# Altium schematic sheet LTC7872.SchDoc
size 985 x 607 mm
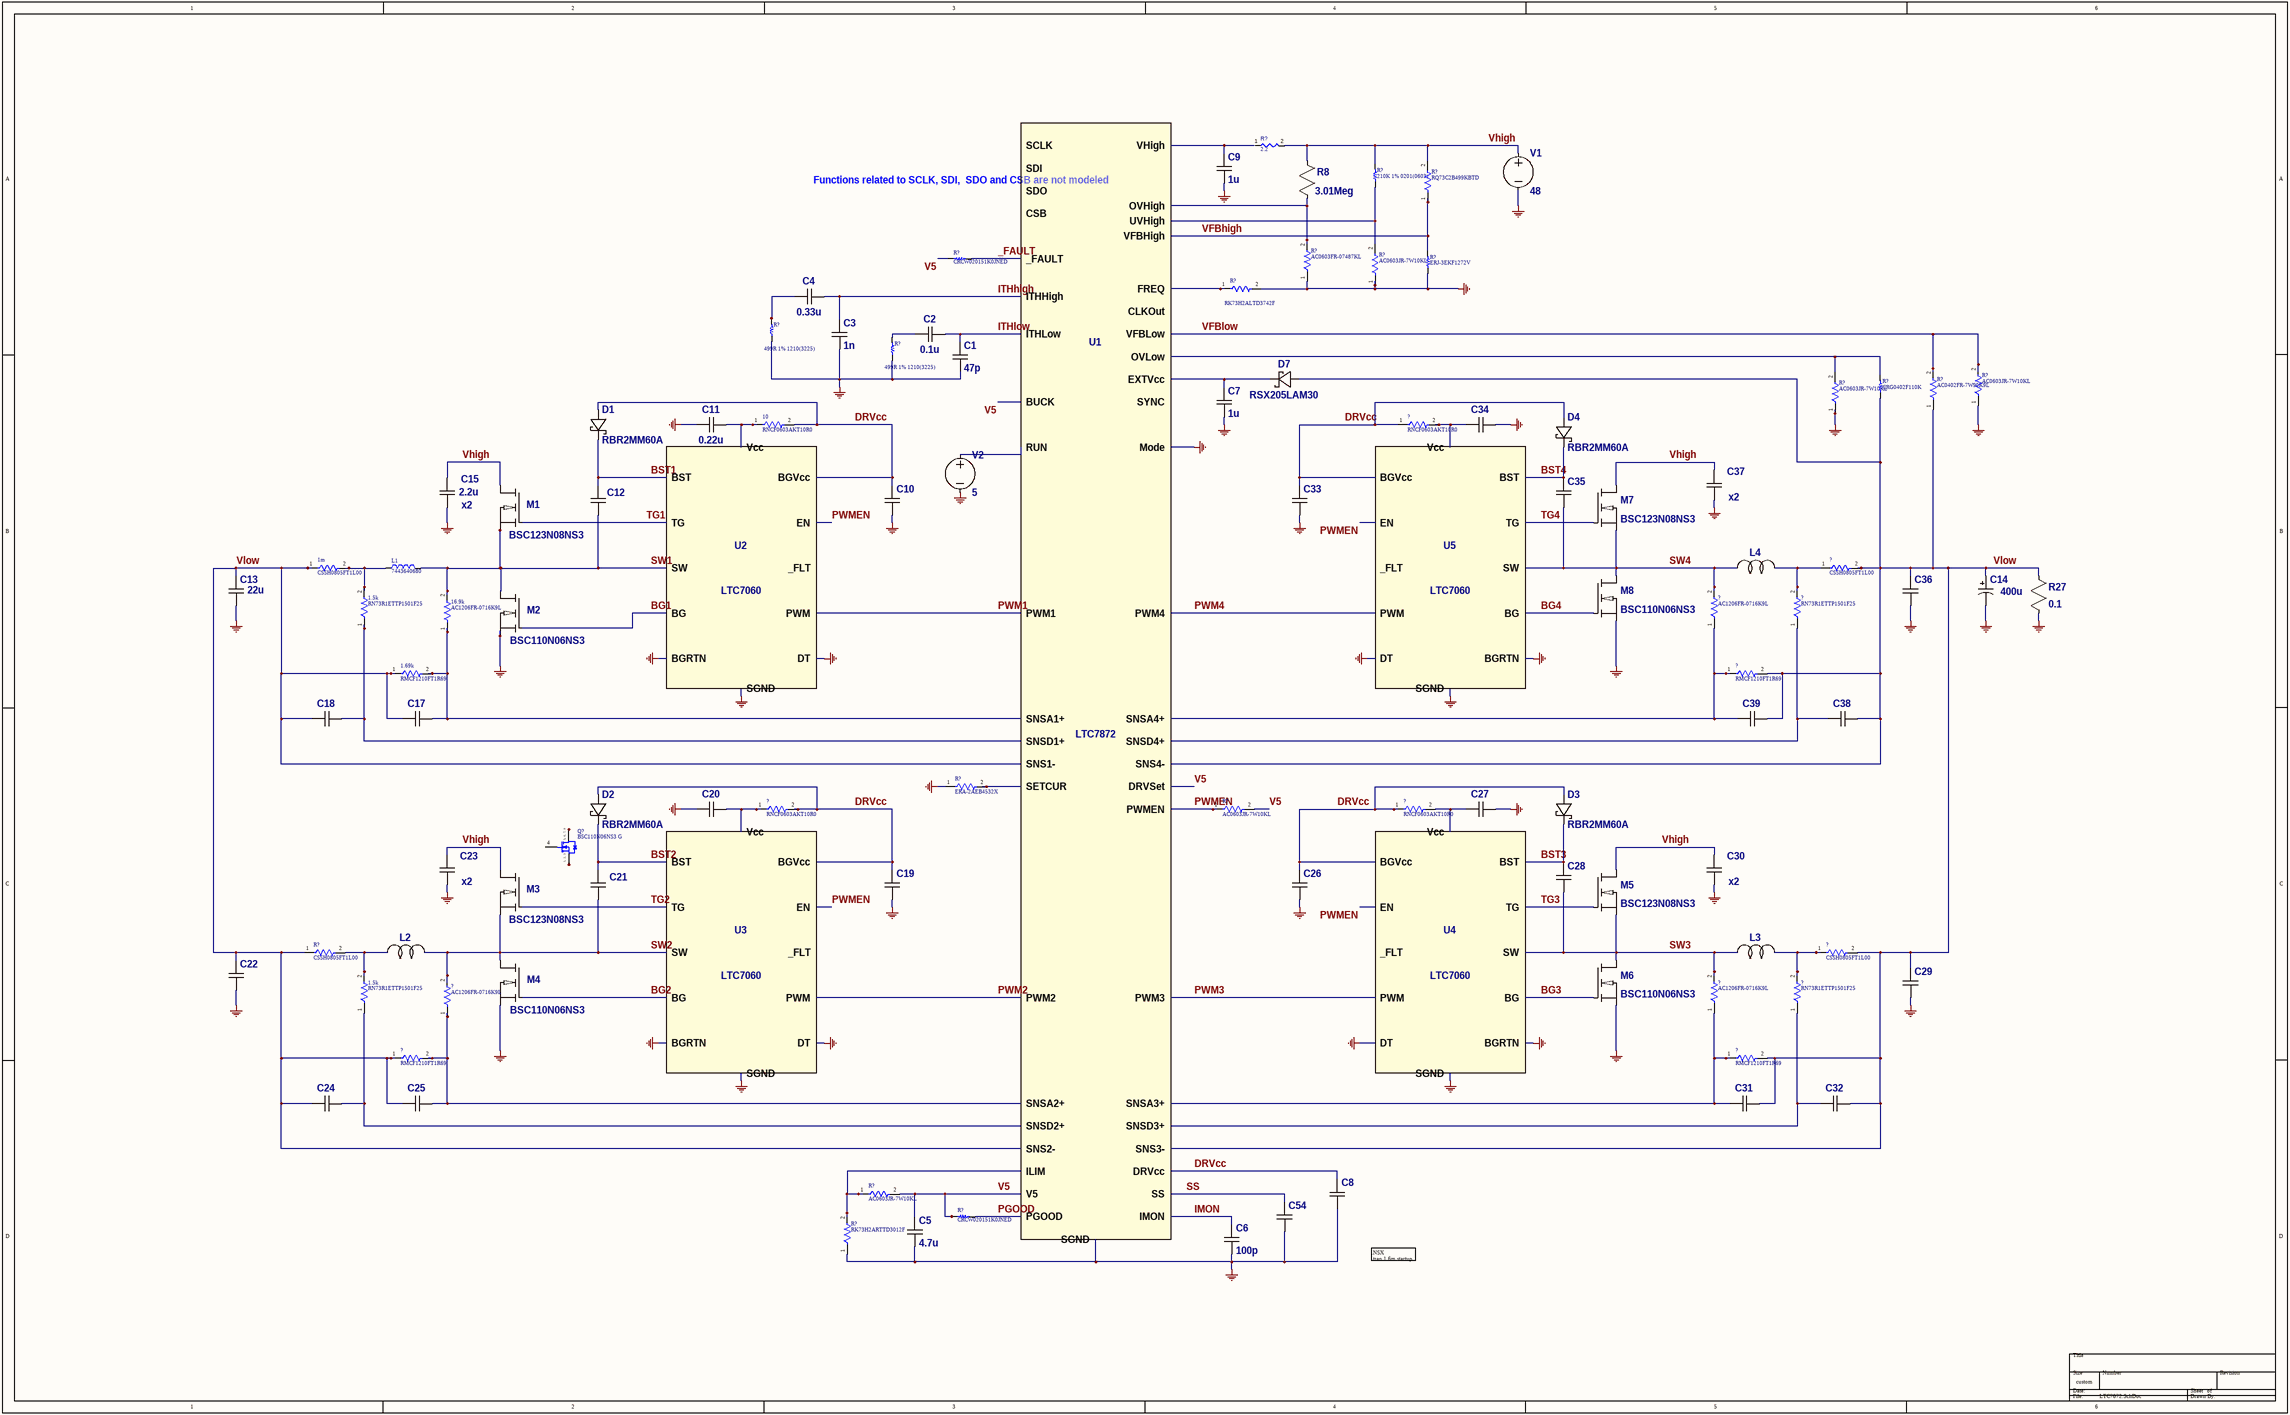
[diagram p0: LTC7872.SchDoc]

## Parts
(Parts that share a designator on the sheet are numbered #1, #2 ... from top to bottom, then left to right.)
1.5k#1  RN73R1ETTP1501F25  [FP-RN73R1E-MFG]
1.5k#2  RN73R1ETTP1501F25  [FP-RN73R1E-MFG]
1.69k  RMCF1210FT1R69  [FP-RMCF1210-IPC_C]
1m  CSSH0805FT1L00  [FP-CSSH0805FT1L00-MFG]
10  RNCF0603AKT10R0  [FP-RNCF0603-MFG]
16.9k  AC1206FR-0716K9L  [FP-AC1206-MFG]
?#1  RNCF0603AKT10R0  [FP-RNCF0603-MFG]
?#2  CSSH0805FT1L00  [FP-CSSH0805FT1L00-MFG]
?#3  AC1206FR-0716K9L  [FP-AC1206-MFG]
?#4  RN73R1ETTP1501F25  [FP-RN73R1E-MFG]
?#5  RMCF1210FT1R69  [FP-RMCF1210-IPC_C]
?#6  RNCF0603AKT10R0  [FP-RNCF0603-MFG]
?#7  RNCF0603AKT10R0  [FP-RNCF0603-MFG]
?#8  CSSH0805FT1L00  [FP-CSSH0805FT1L00-MFG]
?#9  AC1206FR-0716K9L  [FP-AC1206-MFG]
?#10  RN73R1ETTP1501F25  [FP-RN73R1E-MFG]
?#11  AC1206FR-0716K9L  [FP-AC1206-MFG]
?#12  RMCF1210FT1R69  [FP-RMCF1210-IPC_C]
?#13  RMCF1210FT1R69  [FP-RMCF1210-IPC_C]
C1  47p
C2  0.1u
C3  1n
C4  0.33u
C5  4.7u
C6  100p
C7  1u
C8  4.7u  (value not drawn)
C9  1u
C10  1u  (value not drawn)
C11  0.22u
C12  0.22u  (value not drawn)
C13  22u
C14  400u
C15  2.2u  Value2: x2
C17  0.1u  (value not drawn)
C18  0.1u  (value not drawn)
C19  1u  (value not drawn)
C20  0.22u  (value not drawn)
C21  0.22u  (value not drawn)
C22  22u  (value not drawn)
C23  Value2: x2  (hidden comment: 2.2u)
C24  0.1u  (value not drawn)
C25  0.1u  (value not drawn)
C26  1u  (value not drawn)
C27  0.22u  (value not drawn)
C28  0.22u  (value not drawn)
C29  22u  (value not drawn)
C30  Value2: x2  (hidden comment: 2.2u)
C31  0.1u  (value not drawn)
C32  0.1u  (value not drawn)
C33  1u  (value not drawn)
C34  0.22u  (value not drawn)
C35  0.22u  (value not drawn)
C36  22u  (value not drawn)
C37  Value2: x2  (hidden comment: 2.2u)
C38  0.1u  (value not drawn)
C39  0.1u  (value not drawn)
C54  1n  (value not drawn)
D1  RBR2MM60A
D2  RBR2MM60A
D3  RBR2MM60A
D4  RBR2MM60A
D7  RSX205LAM30
L1  7443640680  [WE-HCF_2818]
L2  6.8u  (value not drawn)
L3  6.8u  (value not drawn)
L4  6.8u  (value not drawn)
M1  BSC123N08NS3
M2  BSC110N06NS3
M3  BSC123N08NS3
M4  BSC110N06NS3
M5  BSC123N08NS3
M6  BSC110N06NS3
M7  BSC123N08NS3
M8  BSC110N06NS3
Q?  BSC110N06NS3 G  [INF-PG-TDSON-8-1_V]
R8  3.01Meg
R27  0.1
R?#1  value 2.2  [RESC0402(1005)_L]  (hidden comment: Resistor 2R2  +/-5 % 0402 63 mW)
R?#2  210K 1% 0201(0603)  [RESC0201(0603)_M]
R?#3  RQ73C2B499KBTD  [FP-RQ732B-IPC_C]
R?#4  CRCW020151K0JNED  [RESC0603X28X15ML05T05]
R?#5  ERJ-3EKF1272V  [RESC1608X55X30LL15T15]
R?#6  AC0603FR-07487KL  [FP-AC0603-MFG]
R?#7  AC0603JR-7W10KL  [FP-AC0603-IPC_A]
R?#8  RK73H2ALTD3742F  [FP-RK73H2A-IPC_B]
R?#9  499R 1% 1210(3225)  [RESC1210(3225)_M]
R?#10  499R 1% 1210(3225)  [RESC1210(3225)_M]
R?#11  CRG0402F110K  [RESC1005X40X25ML10T10]
R?#12  AC0603JR-7W10KL  [FP-AC0603-IPC_A]
R?#13  AC0402FR-7W90K9L  [FP-AC0402-IPC_A]
R?#14  AC0603JR-7W10KL  [FP-AC0603-IPC_A]
R?#15  ERA-2AEB4532X  [FP-ERA2A-MFG]
R?#16  AC0603JR-7W10KL  [FP-AC0603-IPC_A]
R?#17  CSSH0805FT1L00  [FP-CSSH0805FT1L00-MFG]
R?#18  AC0603JR-7W10KL  [FP-AC0603-IPC_A]
R?#19  CRCW020151K0JNED  [RESC0603X28X15ML05T05]
R?#20  RK73H2ARTTD3012F  [FP-RK73H2A-IPC_A]
U1  LTC7872  [LXE_05-08-1832_ADI-M]
U2  LTC7060  [MSOP12_MSE_ADI-M]
U3  LTC7060  [MSOP12_MSE_ADI-M]
U4  LTC7060  [MSOP12_MSE_ADI-M]
U5  LTC7060  [MSOP12_MSE_ADI-M]
V1  48
V2  5

## Nets
GND: C1.2(B) C3.2(B) C5.2(B) C6.2(B) C7.2(B) C8.2(B) C9.2(B) C10.2(B) C11.2(B) C13.2(B) C14.2(B) C15.2(B) C19.2(B) C20.2(B) C22.2(B) C23.2(B) C26.2(B) C27.2(B) C29.2(B) C30.2(B) C33.2(B) C34.2(B) C36.2(B) C37.2(B) C54.2(B) M2.3(S) M4.3(S) M6.3(S) M8.3(S) R27.2(B) R?#5.1 R?#6.1 R?#7.1 R?#8.2 R?#9.1 R?#10.1 R?#12.1 R?#14.1 R?#15.1 R?#20.1 U1.4(SGND) U1.37(Mode) U2.4(DT) U2.7(BGRTN) U2.12(SGND) U3.4(DT) U3.7(BGRTN) U3.12(SGND) U4.4(DT) U4.7(BGRTN) U4.12(SGND) U5.4(DT) U5.7(BGRTN) U5.12(SGND) V1.2(-) V2.2(-)
_FAULT: R?#4.2 U1.25(_FAULT)
BG1: M2.2(G) U2.8(BG)
BG2: M4.2(G) U3.8(BG)
BG3: M6.2(G) U4.8(BG)
BG4: M8.2(G) U5.8(BG)
BST1: C12.1(A) D1.2(-) U2.11(BST)
BST2: C21.1(A) D2.2(-) U3.11(BST)
BST3: C28.1(A) D3.2(-) U4.11(BST)
BST4: C35.1(A) D4.2(-) U5.11(BST)
DRVcc: 10.2 ?#1.1 ?#6.2 ?#7.1 C8.1(A) C10.1(A) C19.1(A) C26.1(A) C33.1(A) D1.1(+) D2.1(+) D3.1(+) D4.1(+) U1.33(DRVcc) U2.6(BGVcc) U3.6(BGVcc) U4.6(BGVcc) U5.6(BGVcc)
IMON: C6.1(A) U1.8(IMON)
ITHhigh: C3.1(A) C4.1(A) U1.5(ITHHigh)
ITHlow: C1.1(A) C2.1(A) U1.3(ITHLow)
PGOOD: R?#19.2 U1.22(PGOOD)
PWM1: U1.21(PWM1) U2.1(PWM)
PWM2: U1.23(PWM2) U3.1(PWM)
PWM3: U1.24(PWM3) U4.1(PWM)
PWM4: U1.26(PWM4) U5.1(PWM)
PWMEN: R?#16.1 U1.20(PWMEN) U2.2(EN) U3.2(EN) U4.2(EN) U5.2(EN)
SS: C54.1(A) U1.1(SS)
SW1: 16.9k.2 C12.2(B) L1.2 M1.3(S) M2.1(D) U2.9(SW)
SW2: ?#11.2 C21.2(B) L2.1(A) M3.3(S) M4.1(D) U3.9(SW)
SW3: ?#9.2 C28.2(B) L3.1(A) M5.3(S) M6.1(D) U4.9(SW)
SW4: ?#3.2 C35.2(B) L4.1(A) M7.3(S) M8.1(D) U5.9(SW)
TG1: M1.2(G) U2.10(TG)
TG2: M3.2(G) U3.10(TG)
TG3: M5.2(G) U4.10(TG)
TG4: M7.2(G) U5.10(TG)
V5: C5.1(A) R?#4.1 R?#16.2 R?#18.2 R?#19.1 U1.7(V5) U1.32(DRVSet) U1.40(BUCK)
VFBhigh: R?#3.1 R?#5.2 U1.6(VFBHigh)
VFBlow: R?#12.2 R?#13.2 U1.2(VFBLow)
Vhigh: C15.1(A) C23.1(A) C30.1(A) C37.1(A) M1.1(D) M3.1(D) M5.1(D) M7.1(D) R8.1(A) R?#1.2 R?#2.2 R?#3.2 V1.1(+)
Vlow: 1.69k.1 1m.1 ?#2.2 ?#5.2 ?#8.2 ?#12.1 ?#13.2 C13.1(A) C14.1(A) C17.2(B) C18.2(B) C22.1(A) C24.2(B) C25.2(B) C29.1(A) C31.2(B) C32.2(B) C36.1(A) C38.1(A) C39.1(A) D7.1(+) R27.1(A) R?#11.1 R?#13.1 R?#17.1 U1.14(SNS1-) U1.17(SNS2-) U1.42(SNS3-) U1.45(SNS4-)
Net1.5k#1_1: 1.5k#1.1 C18.1(A) U1.15(SNSD1+)
Net1.5k#1_2: 1.5k#1.2 1m.2 L1.1
Net1.5k#2_1: 1.5k#2.1 C24.1(A) U1.16(SNSD2+)
Net1.5k#2_2: 1.5k#2.2 L2.2(B) R?#17.2
Net1.69k_2: 1.69k.2 16.9k.1 C17.1(A) U1.13(SNSA1+)
Net10_1: 10.1 C11.1(A) U2.5(Vcc)
Net?#1_2: ?#1.2 C34.1(A) U5.5(Vcc)
Net?#2_1: ?#2.1 ?#4.2 L4.2(B)
Net?#3_1: ?#3.1 ?#5.1 C39.2(B) U1.46(SNSA4+)
Net?#4_1: ?#4.1 C38.2(B) U1.44(SNSD4+)
Net?#6_1: ?#6.1 C20.1(A) U3.5(Vcc)
Net?#7_2: ?#7.2 C27.1(A) U4.5(Vcc)
Net?#8_1: ?#8.1 ?#10.2 L3.2(B)
Net?#9_1: ?#9.1 ?#13.1 C31.1(A) U1.41(SNSA3+)
Net?#10_1: ?#10.1 C32.1(A) U1.43(SNSD3+)
Net?#11_1: ?#11.1 ?#12.2 C25.1(A) U1.18(SNSA2+)
NetC2_2: C2.2(B) R?#10.2
NetC4_2: C4.2(B) R?#9.2
NetC7_1: C7.1(A) D7.2(-) U1.31(EXTVcc)
NetC9_1: C9.1(A) U1.34(VHigh)
NetQ?_1: Q?.1(SOURCE) Q?.2(SOURCE) Q?.3(SOURCE)
NetQ?_5: Q?.5(DRAIN) Q?.6(DRAIN) Q?.7(DRAIN) Q?.8(DRAIN)
NetR8_2: R8.2(B) R?#6.2 U1.10(OVHigh)
NetR?#2_1: R?#2.1 R?#7.2 U1.11(UVHigh)
NetR?#8_1: R?#8.1 U1.39(FREQ)
NetR?#11_2: R?#11.2 R?#14.2 U1.12(OVLow)
NetR?#15_2: R?#15.2 U1.9(SETCUR)
NetR?#18_1: R?#18.1 R?#20.2 U1.35(ILIM)
NetU1_19: U1.19(RUN) V2.1(+)

Not connected (* = marked no-connect by the designer): Q? 4(GATE); R?#1 1; U1 27(CSB) 28(SDO) 29(SDI) 30(SCLK) 36(CLKOut) 38(SYNC); U2 3(_FLT); U3 3(_FLT); U4 3(_FLT); U5 3(_FLT)

## Notes on the sheet
- (near U1) Functions related to SCLK, SDI,
  SDO and CSB are not modeled
- .NSX
  .tran 1.6m startup
- (in symbol CMP-1091-00074-1) 5, 6, 7, 8; 1, 2, 3

## Library data of the parts
1.5k#1 1.5k#2 ?#4 ?#10 = CMP-04015-032974-1: 1.5kΩ ±1% 0.063W, 1/16W Chip Resistor 0402 (1005 Metric) Moisture Resistant Thin Film
1.69k ?#5 ?#12 ?#13 = CMP-26527-005845-1: 1.69Ω ±1% 0.5W 1210 Thick Film Chip Resistor AEC-Q200 compliant; Max Power Dissipation: 500mW; Resistance: 1.69R; Temperature Coefficient: 400ppm/°C; Mount: Surface Mount; Case/Package: 1210; Features: Automotive AEC-Q200; Max Operating Temperature: 155°C; Series: RMCF; Number of Terminations: 2; Resistor Type: Thick Film; Contact Plating: Tin; Tolerance: 1%; Min Operating Temperature: -55°C; Packaging: Tape and Reel; Radiation Hardening: No; RoHS Compliant: Yes
1m ?#2 ?#8 R?#17 = CMP-26527-002759-1: RES SHUNT, 0805, 0.001 OHM, 1%,; RoHS Compliant: Yes
10 ?#1 ?#6 ?#7 = CMP-26527-002750-1: RES 10 OHM 0.05% 1/10W 0603; Temperature Coefficient: 10ppm/°C; Max Power Dissipation: 100mW; Resistance: 10R; RoHS Compliant: Yes; Case/Package: 0603; Width: 0.031inch; Min Operating Temperature: -55°C; Features: Moisture Resistant; Tolerance: 0.05%; Case Code (Imperial): 0603; Mount: Surface Mount; Resistor Type: Thin Film; Length: 0.063inch; Height: 0.022inch; Case Code (Metric): 1608; Number of Terminations: 2; Max Operating Temperature: 155°C; Packaging: Tape and Reel
16.9k ?#3 ?#9 ?#11 = CMP-03412-025308-1: RES SMD 16.9K OHM 1% 1/4W 1206; Manufacturer: Yageo; Voltage Rating: 200V; Power Rating: 0.25W; Resistance: 16.9KΩ; Tolerance: 0.01; Automotive Grade: Grade 0; Value: 16.9KΩ; RoHS: TRUE; Category: Res; Composition: Thick Film; Temperature: -55°C to +155°C; Series: AC; Manufacturer Part Number: AC1206FR-0716K9L; Device Class L2: Resistors; Height: 0.65mm; Footprint Url: http://www.yageo.com/exep/pages/download/literatures/PYu-R_Mount_10.pdf; Ipc Land Pattern Name: RESC310160X55; Device Class L1: Passive Components; Device Class L3: Chip SMD Resistors; Lead Free: Yes; Digikey Description: RES SMD 16.9K OHM 1% 1/4W 1206; Octopart: https://octopart.com/ac1206fr-0716k9l-yageo-71367988; ComponentLink2Description: Datasheet; ComponentLink2URL: http://www.yageo.com/NewPortal/yageodocoutput?fileName=/pdf/R-Chip/PYu-AC_51_RoHS_L_6.pdf; Package: AC1206; Temperature Range High: +155°C; Automotive: Yes; Temperature Range Low: -55°C
C1 = cap-47p: InstName: C1; Prefix: C; Value: 47p
C2 = cap-0.1u: InstName: C2; Prefix: C; Value: 0.1u
C3 = cap-1n: InstName: C3; Prefix: C; Value: 1n
C4 = cap-0.33u: InstName: C4; Prefix: C; Value: 0.33u
C5 = cap-4.7u: InstName: C5; Prefix: C; Value: 4.7u
C6 = cap-100p: InstName: C6; Prefix: C; Value: 100p
C7 = cap-1u: InstName: C7; Prefix: C; Value: 1u
C8 = cap-4.7u: InstName: C8; Prefix: C; Value: 4.7u
C9 = cap-1u: InstName: C9; Prefix: C; Value: 1u
C10 = cap-1u: InstName: C10; Prefix: C; Value: 1u
C11 = cap-0.22u: InstName: C11; Prefix: C; Value: 0.22u
C12 = cap-0.22u: InstName: C12; Prefix: C; Value: 0.22u
C13 = cap-22u: InstName: C13; Prefix: C; Value: 22u; SpiceLine: Rser=2m
C14 = polcap-400u: InstName: C14; Prefix: C; Type: cap; Value: 400u; SpiceLine: Rser=0.015
C15 = cap-2.2u: InstName: C15; Prefix: C; Value: 2.2u; SpiceLine: Rser=0.014
C17 = cap-0.1u: InstName: C17; Prefix: C; Value: 0.1u
C18 = cap-0.1u: InstName: C18; Prefix: C; Value: 0.1u
C19 = cap-1u: InstName: C19; Prefix: C; Value: 1u
C20 = cap-0.22u: InstName: C20; Prefix: C; Value: 0.22u
C21 = cap-0.22u: InstName: C21; Prefix: C; Value: 0.22u
C22 = cap-22u: InstName: C22; Prefix: C; Value: 22u; SpiceLine: Rser=2m
C23 = cap-2.2u: InstName: C23; Prefix: C; Value: 2.2u; SpiceLine: Rser=0.014
C24 = cap-0.1u: InstName: C24; Prefix: C; Value: 0.1u
C25 = cap-0.1u: InstName: C25; Prefix: C; Value: 0.1u
C26 = cap-1u: InstName: C26; Prefix: C; Value: 1u
C27 = cap-0.22u: InstName: C27; Prefix: C; Value: 0.22u
C28 = cap-0.22u: InstName: C28; Prefix: C; Value: 0.22u
C29 = cap-22u: InstName: C29; Prefix: C; Value: 22u; SpiceLine: Rser=2m
C30 = cap-2.2u: InstName: C30; Prefix: C; Value: 2.2u; SpiceLine: Rser=0.014
C31 = cap-0.1u: InstName: C31; Prefix: C; Value: 0.1u
C32 = cap-0.1u: InstName: C32; Prefix: C; Value: 0.1u
C33 = cap-1u: InstName: C33; Prefix: C; Value: 1u
C34 = cap-0.22u: InstName: C34; Prefix: C; Value: 0.22u
C35 = cap-0.22u: InstName: C35; Prefix: C; Value: 0.22u
C36 = cap-22u: InstName: C36; Prefix: C; Value: 22u; SpiceLine: Rser=2m
C37 = cap-2.2u: InstName: C37; Prefix: C; Value: 2.2u; SpiceLine: Rser=0.014
C38 = cap-0.1u: InstName: C38; Prefix: C; Value: 0.1u
C39 = cap-0.1u: InstName: C39; Prefix: C; Value: 0.1u
C54 = cap-1n: InstName: C54; Prefix: C; Value: 1n
D1 = schottky-RBR2MM60A: InstName: D1; Prefix: D; Type: diode; Value: RBR2MM60A
D2 = schottky-RBR2MM60A: InstName: D2; Prefix: D; Type: diode; Value: RBR2MM60A
D3 = schottky-RBR2MM60A: InstName: D3; Prefix: D; Type: diode; Value: RBR2MM60A
D4 = schottky-RBR2MM60A: InstName: D4; Prefix: D; Type: diode; Value: RBR2MM60A
D7 = schottky-RSX205LAM30: InstName: D7; Prefix: D; Type: diode; Value: RSX205LAM30
L1 = CMP-1378-00007-3: NexarPartId: 46948336; Test Frequency: 100kHz; DC Resistance (DCR): 2.4mΩ; Saturation Current: 55A; Current Rating: 30A; Tolerance: 15%; Inductance: 6.8µH; Shielding: Shielded; Self Resonant Frequency: 17MHz; Core Material: Ferrite; Ambient Temperature Range Low: -40°C; Height: 18.5mm; Mount: Surface Mount; Termination: SMD/SMT; Width: 28mm; Composition: Wirewound; Ambient Temperature Range High: 75°C; RoHS: Compliant; Max DC Current: 30A; Packaging: Cut Tape; Inductance Tolerance: 15%; Number of Pins: 2; Length: 27mm; Height - Seated (Max): 18.4912mm; RMS Current (Irms): 30A; Case/Package: Nonstandard; Max Operating Temperature: 125°C; Series Resistance: 2.4mΩ; REACH SVHC: Unknown; Min Operating Temperature: -40°C
L2 = ind-6.8u: InstName: L2; Prefix: L; Value: 6.8u; SpiceLine: Rser=1m
L3 = ind-6.8u: InstName: L3; Prefix: L; Value: 6.8u; SpiceLine: Rser=1m
L4 = ind-6.8u: InstName: L4; Prefix: L; Value: 6.8u; SpiceLine: Rser=1m
M1 M3 = NMOS-BSC123N08NS3: InstName: M3; Prefix: MN; Value: BSC123N08NS3
M2 M4 = NMOS-BSC110N06NS3: InstName: M4; Prefix: MN; Value: BSC110N06NS3
M5 = NMOS-BSC123N08NS3: InstName: M5; Prefix: MN; Value: BSC123N08NS3
M6 = NMOS-BSC110N06NS3: InstName: M6; Prefix: MN; Value: BSC110N06NS3
M7 = NMOS-BSC123N08NS3: InstName: M7; Prefix: MN; Value: BSC123N08NS3
M8 = NMOS-BSC110N06NS3: InstName: M8; Prefix: MN; Value: BSC110N06NS3
Q? = CMP-1091-00074-1: N-Channel OptiMOS 3 Power-Transistor, 60 V VDS, 50 A ID, -55 to 150 degC, PG-TDSON-8-1, Reel, Green; Manufacturer: Infineon; RDS (on) (max): 11Â mOhm; ID (max): 50Â A; VGS(th) (max): 4Â V; RthJA (max): 62 K/W; Ptot (max): 50Â W; VGS(th) (min): 2Â V; VDS (max): 60Â V; QG: 25Â nC; IDpuls (max): 200Â A; Polarity: N; Rth: 2.5Â K/W; Green: TRUE; Packing: Reel; DatasheetVersion: Rev. 2.3; ComponentLink2URL: http://www.infineon.com/dgdl/BSC110N06NS3_Rev2.3.pdf?folderId=db3a30431ddc9372011ebafa04517f8b&fileId=db3a30431ddc9372011ebb0be43c7fe6; ComponentLink1Description: Manufacturer URL; PackageDescription: 8-Pin Plastic (Green) Thin Dual Small Outline Non-Leaded Package, 5.15 x 5.9 mm Body, 1.27 mm Pitch; ComponentLink3Description: Package Specification; PackageReference: PG-TDSON-8-1; ComponentLink1URL: http://www.infineon.com/; ComponentLink3URL: http://www.infineon.com/cms/packages/SMD_-_Surface_Mounted_Devices/P-PG-TDSON/P-PG-TDSON-08-01x_2x_3.html?__locale=en; ComponentLink2Description: Datasheet; Halogen-free: TRUE; PartNumber: BSC110N06NS3 G; Mounting Technology: Surface Mount; RthJC (max): 2.5Â K/W
R8 = res-3.01Meg: InstName: R8; Prefix: R; Value: 3.01Meg
R27 = res-0.1: InstName: R27; Prefix: R; Value: 0.1
R?#1 = CMP-009-00128-3: Chip Resistor, 2,2 Ohms, +/-5 %, 63 mW, -55 to 155 degC, 0402; Power: 63mW; Tolerance: 5%; Pins: 2; Case/Package: 0402; Min Operating Temperature: -55°C; Max Operating Temperature: 155°C
R?#2 = CMP-1010-00676-1: 210K 0.05W 1% 0201 (0603 Metric)  SMD; Case-Metric: 0603; Case-EIA: 0201; Value: 210000.00 Ohm; Power: 0.05 W; Technology: SMT; Tolerance: 1 %
R?#3 = CMP-03211-002016-1: RQ732B 1206 499KΩ 0.4W 10ppm/°C 0.1% 200V; Manufacturer: TE; Automotive Grade: Grade 0; Device Class L2: Resistors; Height: 0.75mm; Tolerance: 0.1%; Octopart: https://octopart.com/5-2176392-6-te+connectivity-93905009; ComponentLink2Description: Datasheet; Manufacturer Part Number: RQ73C2B499KBTD; Lead Free: Yes; Temperature Range High: +155°C; RoHS: TRUE; Category: Res; Voltage Rating: 200V; Temperature Coefficient: 10ppm/°C; Package: RQ732B; Power Rating: 0.4W; Device Class L1: Passive Components; Device Class L3: Chip SMD Resistors; ComponentLink2URL: https://www.te.com/commerce/DocumentDelivery/DDEController?Action=showdoc&DocId=Data+Sheet%7F1773270-2%7FA%7Fpdf%7FEnglish%7FENG_DS_1773270-2_A.pdf%7F9-2176388-657; Temperature: -55°C to +155°C; Value: 499KΩ; Ipc Land Pattern Name: RESC310160X60; Resistance: 499KΩ; Composition: Thin Film; Temperature Range Low: -55°C; Series: RQ73; Automotive: Yes
R?#4 R?#19 = CMP-2004-00693-1: Manufacturer: Vishay Dale; Part Number: CRCW020151K0JNED
R?#5 = CMP-2000-00228-1: Manufacturer: Panasonic; Part Number: ERJ-3EKF1272V
R?#6 = CMP-03412-025966-2: RES 487KΩ 1.00% 0.1W 0603; Tolerance: 1%; Temperature Coefficient: 100ppm/°C; Resistance: 487kR; Voltage Rating: 50V; Power Rating: 100mW; Resistor Type: Thick Film; Number of Terminations: 2; Series: AC; Termination: SMD/SMT; Features: Moisture Resistant; Max Operating Temperature: 155°C; Packaging: Tape and Reel; Length: 0.063inch; Height: 0.022inch; Case Code (Metric): 1608; Min Operating Temperature: -55°C; Case Code (Imperial): 0603; RoHS Compliant: Yes; Case/Package: 0603; Max Power Dissipation: 100mW; Width: 0.8mm
R?#7 R?#12 R?#14 R?#16 R?#18 = CMP-03412-040683-1: RES 10kΩ 5.00% 0.2W 0603
R?#8 = CMP-04015-073905-1: 37.4kΩ ±1% 0.25W Chip Resistor 0805 Thick Film AEC-Q200 Qualified; Voltage Rating: 150V; Resistance: 37.4kR; Power Rating: 125mW; Temperature Coefficient: 100ppm/°C; Packaging: Tape and Reel; Lead Free: Contains Lead; Case/Package: 0805; Min Operating Temperature: -55°C; Length: 2mm; Construction: Rectangular; Depth: 1.25mm; RoHS Compliant: No; Height: 0.5mm; Case Code (Metric): 2012; Tolerance: 1%; Case Code (Imperial): 0805; Weight: 0.000194oz; Width: 1.25mm; Termination: SMD/SMT; Military Standard: Not; Resistor Type: Thick Film; Series: RK73H; Max Operating Temperature: 155°C
R?#9 R?#10 = CMP-1015-00476-1: 499R 0.5W 1% 1210 (3225 Metric)  SMD; Value: 499.00 Ohm; Case-EIA: 1210; Case-Metric: 3225; Technology: SMT; Tolerance: 1 %; Power: 0.5 W
R?#11 = CMP-2002-05681-1: Manufacturer: TE Connectivity / AMP; Part Number: CRG0402F110K
R?#13 = CMP-03412-045161-1: RES 90.9kΩ ±1% 0.125W 0402; RoHS Compliant: Yes
R?#15 = CMP-05422-000108-1: RES SMD 45.3KOHM 0.1% 1/16W 0402; Resistance: 45.3kR; Max Power Dissipation: 63mW; Temperature Coefficient: 25ppm/°C; Power Rating: 62.5mW; Voltage Rating (DC): 50V; Weight: 2.8E-05oz; RoHS Compliant: Yes; Depth: 0.5mm; Termination: SMD/SMT; Max Operating Temperature: 155°C; Construction: Rectangular; Length: 1mm; Height: 0.016inch; Contact Plating: Tin; Case/Package: 0402; Case Code (Metric): 1005; Military Standard: Not; Tolerance: 0.1%; Lead Free: Lead Free; Width: 0.02inch; Packaging: Tape and Reel; Case Code (Imperial): 0402; Voltage Rating: 50V; Number of Terminations: 2; Resistance Tolerance: 0.1%; Resistor Type: Thin Film; Package Quantity: 10000; Min Operating Temperature: -55°C; Mount: Surface Mount; Series: ERA-2A
R?#20 = CMP-04015-090999-1: 30.1kΩ ±1% 0.25W Chip Resistor 0805 Flat Chip (Anti-Sulfuration) AEC-Q200 Qualified; Voltage Rating: 150V; Power Rating: 125mW; Temperature Coefficient: 100ppm/°C; Resistance: 30.1kR; Tolerance: 1%; Termination: SMD/SMT; Case/Package: 0805; Width: 1.2mm; Min Operating Temperature: -55°C; Packaging: Tape and Reel; RoHS Compliant: Yes; Case Code (Imperial): 0805; Weight: 0.000194oz; Package Quantity: 5000; Length: 2mm; Case Code (Metric): 2012; Max Operating Temperature: 155°C; Height: 0.5mm
U1 = LTC7872: InstName: U1; Prefix: X; Value: LTC7872; SpiceModel: LTC7872.sub; Value2: LTC7872
U2 = LTC7060: InstName: U2; Prefix: X; Value: LTC7060; SpiceModel: LTC7060.sub; Value2: LTC7060
U3 = LTC7060: InstName: U3; Prefix: X; Value: LTC7060; SpiceModel: LTC7060.sub; Value2: LTC7060
U4 = LTC7060: InstName: U4; Prefix: X; Value: LTC7060; SpiceModel: LTC7060.sub; Value2: LTC7060
U5 = LTC7060: InstName: U5; Prefix: X; Value: LTC7060; SpiceModel: LTC7060.sub; Value2: LTC7060
V1 = voltage-48: voltage source; InstName: V1; Prefix: V; Value: 48
V2 = voltage-5: voltage source; InstName: V2; Prefix: V; Value: 5